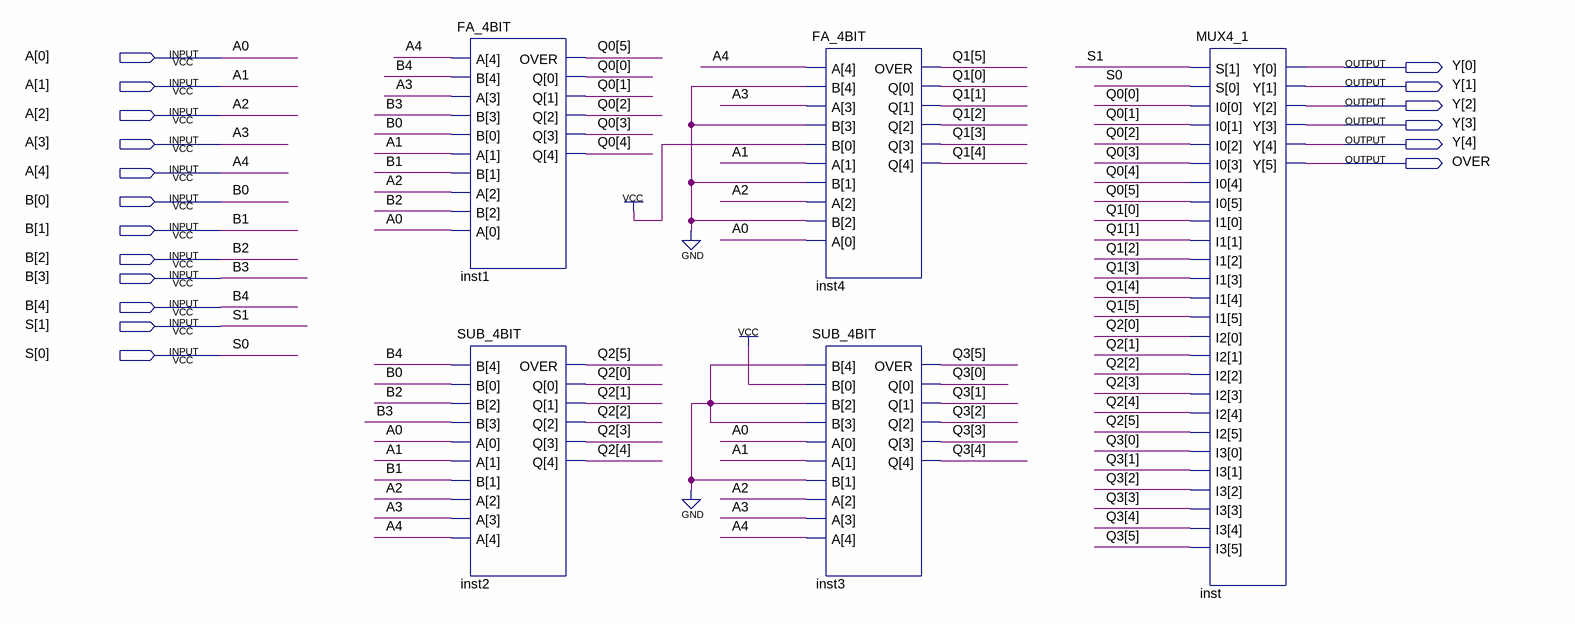
[diagram p0: schematic sheet]
// Quartus schematic AU.bdf as structural Verilog: 5 symbols, 18 pins
module AU (
  input  [4:0] A,
  input  [4:0] B,
  input  [1:0] S,
  output [4:0] Y,
  output OVER
);

  wire [5:0] Q0, Q1, Q2, Q3;

  FA_4BIT inst1 (.A(A), .B(B), .OVER(Q0[5]), .Q(Q0[4:0]));
  SUB_4BIT inst2 (.B(B), .A(A), .OVER(Q2[5]), .Q(Q2[4:0]));
  FA_4BIT inst4 (.A(A), .B(5'b00001), .OVER(Q1[5]), .Q(Q1[4:0]));
  SUB_4BIT inst3 (.B(5'b00001), .A(A), .OVER(Q3[5]), .Q(Q3[4:0]));
  MUX4_1 inst (.S(S), .I0(Q0), .I1(Q1), .I2(Q2), .I3(Q3), .Y({OVER, Y}));
endmodule
